# Altium schematic sheet 33_PP0_CONFIG.SchDoc
size 419 x 296 mm; Author: Serbinov O.A.; CompanyName: ELSICOM; DrawnBy: Serbinov O.A.; Engineer: Serbinov O.A.; Organization: Elsicom; Address1: Kirova avenue, 58; Address2: Tomsk; Address3: Russia 634012; DocumentNumber: 34; SheetNumber: 34; SheetTotal: 44; ProjectName: 48_PORTS
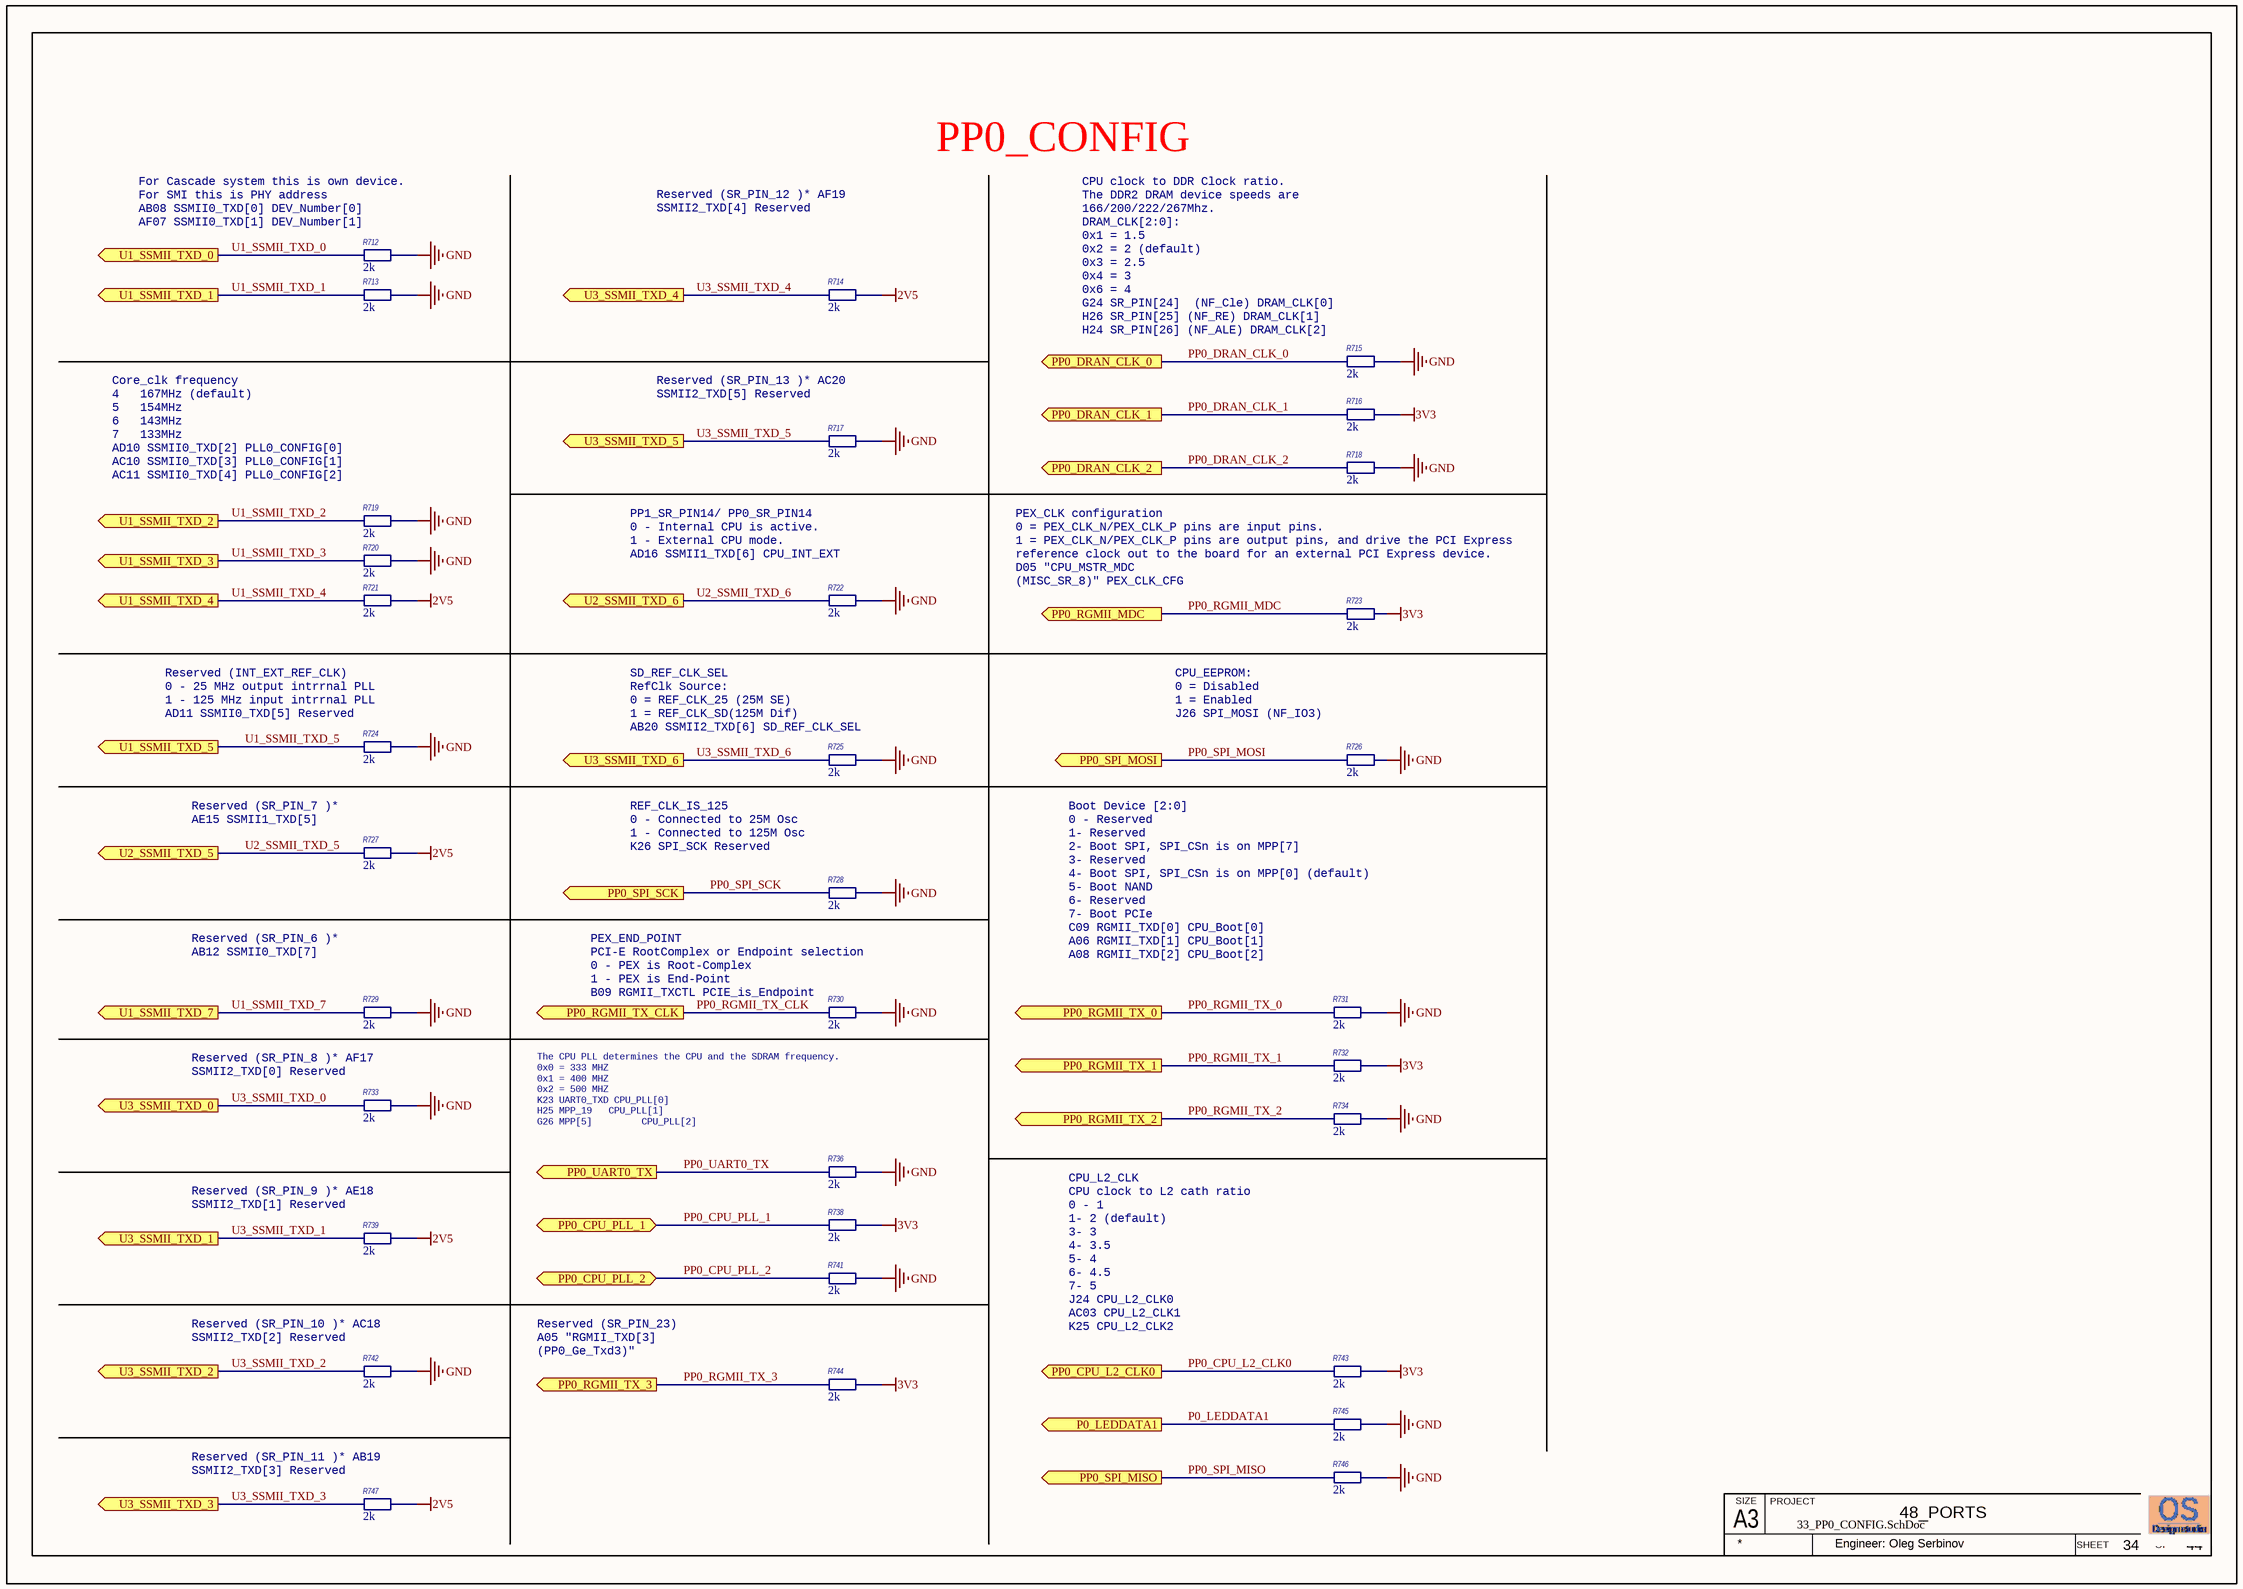
[diagram p0: 33_PP0_CONFIG.SchDoc]

## Parts
R712  Resistance (Ohms): 2k  [R0402_IPC High Density]  (hidden comment: ERJ-2RKF2001X)
R713  Resistance (Ohms): 2k  [R0402_IPC High Density]  (hidden comment: ERJ-2RKF2001X)
R714  Resistance (Ohms): 2k  [R0402_IPC High Density]  (hidden comment: ERJ-2RKF2001X)
R715  Resistance (Ohms): 2k  [R0402_IPC High Density]  (hidden comment: ERJ-2RKF2001X)
R716  Resistance (Ohms): 2k  [R0402_IPC High Density]  (hidden comment: ERJ-2RKF2001X)
R717  Resistance (Ohms): 2k  [R0402_IPC High Density]  (hidden comment: ERJ-2RKF2001X)
R718  Resistance (Ohms): 2k  [R0402_IPC High Density]  (hidden comment: ERJ-2RKF2001X)
R719  Resistance (Ohms): 2k  [R0402_IPC High Density]  (hidden comment: ERJ-2RKF2001X)
R720  Resistance (Ohms): 2k  [R0402_IPC High Density]  (hidden comment: ERJ-2RKF2001X)
R721  Resistance (Ohms): 2k  [R0402_IPC High Density]  (hidden comment: ERJ-2RKF2001X)
R722  Resistance (Ohms): 2k  [R0402_IPC High Density]  (hidden comment: ERJ-2RKF2001X)
R723  Resistance (Ohms): 2k  [R0402_IPC High Density]  (hidden comment: ERJ-2RKF2001X)
R724  Resistance (Ohms): 2k  [R0402_IPC High Density]  (hidden comment: ERJ-2RKF2001X)
R725  Resistance (Ohms): 2k  [R0402_IPC High Density]  (hidden comment: ERJ-2RKF2001X)
R726  Resistance (Ohms): 2k  [R0402_IPC High Density]  (hidden comment: ERJ-2RKF2001X)
R727  Resistance (Ohms): 2k  [R0402_IPC High Density]  (hidden comment: ERJ-2RKF2001X)
R728  Resistance (Ohms): 2k  [R0402_IPC High Density]  (hidden comment: ERJ-2RKF2001X)
R729  Resistance (Ohms): 2k  [R0402_IPC High Density]  (hidden comment: ERJ-2RKF2001X)
R730  Resistance (Ohms): 2k  [R0402_IPC High Density]  (hidden comment: ERJ-2RKF2001X)
R731  Resistance (Ohms): 2k  [R0402_IPC High Density]  (hidden comment: ERJ-2RKF2001X)
R732  Resistance (Ohms): 2k  [R0402_IPC High Density]  (hidden comment: ERJ-2RKF2001X)
R733  Resistance (Ohms): 2k  [R0402_IPC High Density]  (hidden comment: ERJ-2RKF2001X)
R734  Resistance (Ohms): 2k  [R0402_IPC High Density]  (hidden comment: ERJ-2RKF2001X)
R736  Resistance (Ohms): 2k  [R0402_IPC High Density]  (hidden comment: ERJ-2RKF2001X)
R738  Resistance (Ohms): 2k  [R0402_IPC High Density]  (hidden comment: ERJ-2RKF2001X)
R739  Resistance (Ohms): 2k  [R0402_IPC High Density]  (hidden comment: ERJ-2RKF2001X)
R741  Resistance (Ohms): 2k  [R0402_IPC High Density]  (hidden comment: ERJ-2RKF2001X)
R742  Resistance (Ohms): 2k  [R0402_IPC High Density]  (hidden comment: ERJ-2RKF2001X)
R743  Resistance (Ohms): 2k  [R0402_IPC High Density]  (hidden comment: ERJ-2RKF2001X)
R744  Resistance (Ohms): 2k  [R0402_IPC High Density]  (hidden comment: ERJ-2RKF2001X)
R745  Resistance (Ohms): 2k  [R0402_IPC High Density]  (hidden comment: ERJ-2RKF2001X)
R746  Resistance (Ohms): 2k  [R0402_IPC High Density]  (hidden comment: ERJ-2RKF2001X)
R747  Resistance (Ohms): 2k  [R0402_IPC High Density]  (hidden comment: ERJ-2RKF2001X)

## Ports
P0_LEDDATA1 (out), PP0_CPU_L2_CLK0 (out), PP0_CPU_PLL_1 (bidir), PP0_CPU_PLL_2 (bidir), PP0_DRAN_CLK_0 (out), PP0_DRAN_CLK_1 (out), PP0_DRAN_CLK_2 (out), PP0_RGMII_MDC (out), PP0_RGMII_TX_0 (out), PP0_RGMII_TX_1 (out), PP0_RGMII_TX_2 (out), PP0_RGMII_TX_3 (out), PP0_RGMII_TX_CLK (out), PP0_SPI_MISO (out), PP0_SPI_MOSI (out), PP0_SPI_SCK (out), PP0_UART0_TX (out), U1_SSMII_TXD_0 (out), U1_SSMII_TXD_1 (out), U1_SSMII_TXD_2 (out), U1_SSMII_TXD_3 (out), U1_SSMII_TXD_4 (out), U1_SSMII_TXD_5 (out), U1_SSMII_TXD_7 (out), U2_SSMII_TXD_5 (out), U2_SSMII_TXD_6 (out), U3_SSMII_TXD_0 (out), U3_SSMII_TXD_1 (out), U3_SSMII_TXD_2 (out), U3_SSMII_TXD_3 (out), U3_SSMII_TXD_4 (out), U3_SSMII_TXD_5 (out), U3_SSMII_TXD_6 (out)

## Nets
2V5: R714.2 R721.2 R727.2 R739.2 R747.2
3V3: R716.2 R723.2 R732.2 R738.2 R743.2 R744.2
GND: R712.2 R713.2 R715.2 R717.2 R718.2 R719.2 R720.2 R722.2 R724.2 R725.2 R726.2 R728.2 R729.2 R730.2 R731.2 R733.2 R734.2 R736.2 R741.2 R742.2 R745.2 R746.2
P0_LEDDATA1: R745.1 ; port P0_LEDDATA1
PP0_CPU_L2_CLK0: R743.1 ; port PP0_CPU_L2_CLK0
PP0_CPU_PLL_1: R738.1 ; port PP0_CPU_PLL_1
PP0_CPU_PLL_2: R741.1 ; port PP0_CPU_PLL_2
PP0_DRAN_CLK_0: R715.1 ; port PP0_DRAN_CLK_0
PP0_DRAN_CLK_1: R716.1 ; port PP0_DRAN_CLK_1
PP0_DRAN_CLK_2: R718.1 ; port PP0_DRAN_CLK_2
PP0_RGMII_MDC: R723.1 ; port PP0_RGMII_MDC
PP0_RGMII_TX_0: R731.1 ; port PP0_RGMII_TX_0
PP0_RGMII_TX_1: R732.1 ; port PP0_RGMII_TX_1
PP0_RGMII_TX_2: R734.1 ; port PP0_RGMII_TX_2
PP0_RGMII_TX_3: R744.1 ; port PP0_RGMII_TX_3
PP0_RGMII_TX_CLK: R730.1 ; port PP0_RGMII_TX_CLK
PP0_SPI_MISO: R746.1 ; port PP0_SPI_MISO
PP0_SPI_MOSI: R726.1 ; port PP0_SPI_MOSI
PP0_SPI_SCK: R728.1 ; port PP0_SPI_SCK
PP0_UART0_TX: R736.1 ; port PP0_UART0_TX
U1_SSMII_TXD_0: R712.1 ; port U1_SSMII_TXD_0
U1_SSMII_TXD_1: R713.1 ; port U1_SSMII_TXD_1
U1_SSMII_TXD_2: R719.1 ; port U1_SSMII_TXD_2
U1_SSMII_TXD_3: R720.1 ; port U1_SSMII_TXD_3
U1_SSMII_TXD_4: R721.1 ; port U1_SSMII_TXD_4
U1_SSMII_TXD_5: R724.1 ; port U1_SSMII_TXD_5
U1_SSMII_TXD_7: R729.1 ; port U1_SSMII_TXD_7
U2_SSMII_TXD_5: R727.1 ; port U2_SSMII_TXD_5
U2_SSMII_TXD_6: R722.1 ; port U2_SSMII_TXD_6
U3_SSMII_TXD_0: R733.1 ; port U3_SSMII_TXD_0
U3_SSMII_TXD_1: R739.1 ; port U3_SSMII_TXD_1
U3_SSMII_TXD_2: R742.1 ; port U3_SSMII_TXD_2
U3_SSMII_TXD_3: R747.1 ; port U3_SSMII_TXD_3
U3_SSMII_TXD_4: R714.1 ; port U3_SSMII_TXD_4
U3_SSMII_TXD_5: R717.1 ; port U3_SSMII_TXD_5
U3_SSMII_TXD_6: R725.1 ; port U3_SSMII_TXD_6

## Notes on the sheet
- PP0_CONFIG
- (near R712) For Cascade system this is own device.
  For SMI this is PHY address
  AB08	SSMII0_TXD[0]	DEV_Number[0]
  AF07	SSMII0_TXD[1]	DEV_Number[1]
- Reserved (SR_PIN_12 )*	AF19
  SSMII2_TXD[4]	Reserved
- (near R715) CPU clock to DDR Clock ratio.
  The DDR2 DRAM device speeds are 166/200/222/267Mhz.
  DRAM_CLK[2:0]:
  0x1 = 1.5
  0x2 = 2 (default)
  0x3 = 2.5
  0x4 = 3
  0x6 = 4
  G24	SR_PIN[24]  (NF_Cle)	DRAM_CLK[0]
  H26	SR_PIN[25] (NF_RE)	DRAM_CLK[1]
  H24	SR_PIN[26] (NF_ALE)	DRAM_CLK[2]
- (near R717) Reserved (SR_PIN_13 )*	AC20
  SSMII2_TXD[5]	Reserved
- (near R719) Core_clk frequency
  4   167MHz (default)
  5   154MHz
  6   143MHz
  7   133MHz
  AD10	SSMII0_TXD[2]	PLL0_CONFIG[0]
  AC10	SSMII0_TXD[3]	PLL0_CONFIG[1]
  AC11	SSMII0_TXD[4]	PLL0_CONFIG[2]
- (near R722) PP1_SR_PIN14/ PP0_SR_PIN14
  0 - Internal CPU is active.
  1 - External CPU mode.
  AD16	SSMII1_TXD[6]	CPU_INT_EXT
- PEX_CLK configuration
  0 = PEX_CLK_N/PEX_CLK_P pins are input pins.
  1 = PEX_CLK_N/PEX_CLK_P pins are output pins, and drive the PCI Express reference clock out to the board for an external PCI Express device.
  D05	"CPU_MSTR_MDC
  (MISC_SR_8)"	PEX_CLK_CFG
- (near R724) Reserved (INT_EXT_REF_CLK)
  0 - 25 MHz output intrrnal PLL
  1 - 125 MHz input intrrnal PLL
  AD11	SSMII0_TXD[5]	Reserved
- (near R725) SD_REF_CLK_SEL
  RefClk Source:
  0 = REF_CLK_25 (25M SE)
  1 = REF_CLK_SD(125M Dif)
  AB20	SSMII2_TXD[6]	SD_REF_CLK_SEL
- CPU_EEPROM:
  0 = Disabled
  1 = Enabled
  J26	SPI_MOSI (NF_IO3)	CPU_EEPROM_EN
- (near R727) Reserved (SR_PIN_7 )*
  AE15	SSMII1_TXD[5]
- REF_CLK_IS_125
  0 - Connected to 25M Osc
  1 - Connected to 125M Osc
  K26	SPI_SCK	Reserved
- (near R729) Reserved (SR_PIN_6 )*
  AB12	SSMII0_TXD[7]
- Boot Device [2:0]
  0 - Reserved
  1- Reserved
  2- Boot SPI, SPI_CSn is on MPP[7]
  3- Reserved
  4- Boot SPI, SPI_CSn is on MPP[0] (default)
  5- Boot NAND
  6- Reserved
  7- Boot PCIe
  C09	RGMII_TXD[0]	CPU_Boot[0]
  A06	RGMII_TXD[1]	CPU_Boot[1]
  A08	RGMII_TXD[2]	CPU_Boot[2]
- (near R730) PEX_END_POINT
  PCI-E RootComplex or Endpoint selection
  0 - PEX is Root-Complex
  1 - PEX is End-Point
  B09	RGMII_TXCTL	PCIE_is_Endpoint
- (near R733) Reserved (SR_PIN_8 )*	AF17
  SSMII2_TXD[0]	Reserved
- The CPU PLL determines the CPU and the SDRAM frequency.
  0x0 = 333 MHZ
  0x1 = 400 MHZ
  0x2 = 500 MHZ
  K23	UART0_TXD	CPU_PLL[0]
  H25	MPP_19  	CPU_PLL[1]
  G26	MPP[5]	        CPU_PLL[2]
- (near R739) Reserved (SR_PIN_9 )*	AE18
  SSMII2_TXD[1]	Reserved
- CPU_L2_CLK
  CPU clock to L2 cath ratio
  0 - 1
  1- 2 (default)
  3- 3
  4- 3.5
  5- 4
  6- 4.5
  7- 5
  J24	CPU_L2_CLK0
  AC03	CPU_L2_CLK1
  K25	CPU_L2_CLK2
- (near R742) Reserved (SR_PIN_10 )*	AC18
  SSMII2_TXD[2]	Reserved
- (near R744) Reserved (SR_PIN_23)
  A05	"RGMII_TXD[3]
  (PP0_Ge_Txd3)"
- (near R747) Reserved (SR_PIN_11 )*	AB19
  SSMII2_TXD[3]	Reserved
- A3
- SIZE
- PROJECT
- SHEET
- OF
- Engineer: Oleg Serbinov

## Library data of the parts
R712-R734 R736 R738 R739 R741-R747 = ERJ-2RKF2001X: R0402, 2k 1%; Manufacturer: Panasonic; Customer Part Number: Резистор, 2K, 0402, 1%; Temperature Coefficient: ±100ppm/°C; Power (Watts): 0.1W, 1/10W; Analogs: any suitable; Tolerance: ±1%; Packaging: Tape & Reel (TR); Package / Case: 0402 (1005 Metric); Category: Resistors; Manufacturer Part Number: ERJ-2RKF2001X; Supplier Part Number: P2.00KLTR-ND; RoHS: RoHS Compliant; Supplier: Digi-Key; ComponentLink1URL: http://industrial.panasonic.com/www-cgi/jvcr13pz.cgi?E+PZ+3+AOA0002+ERJ2RKF2001X+7+WW; ComponentLink1Description: http://industrial.panasonic.com/www-cgi/jvcr13pz.cgi?E+PZ+3+AOA0002+ERJ2RKF2001X+7+WW; Pricing: 10000=0.00347, 30000=0.00305, 50000=0.00279, 100000=0.00274 (USD); Features: -; Height: 0.016" (0.40mm); Size / Dimension: 0.039" L x 0.020" W (1.00mm x 0.50mm); Composition: Thick Film; Number of Terminations: 2